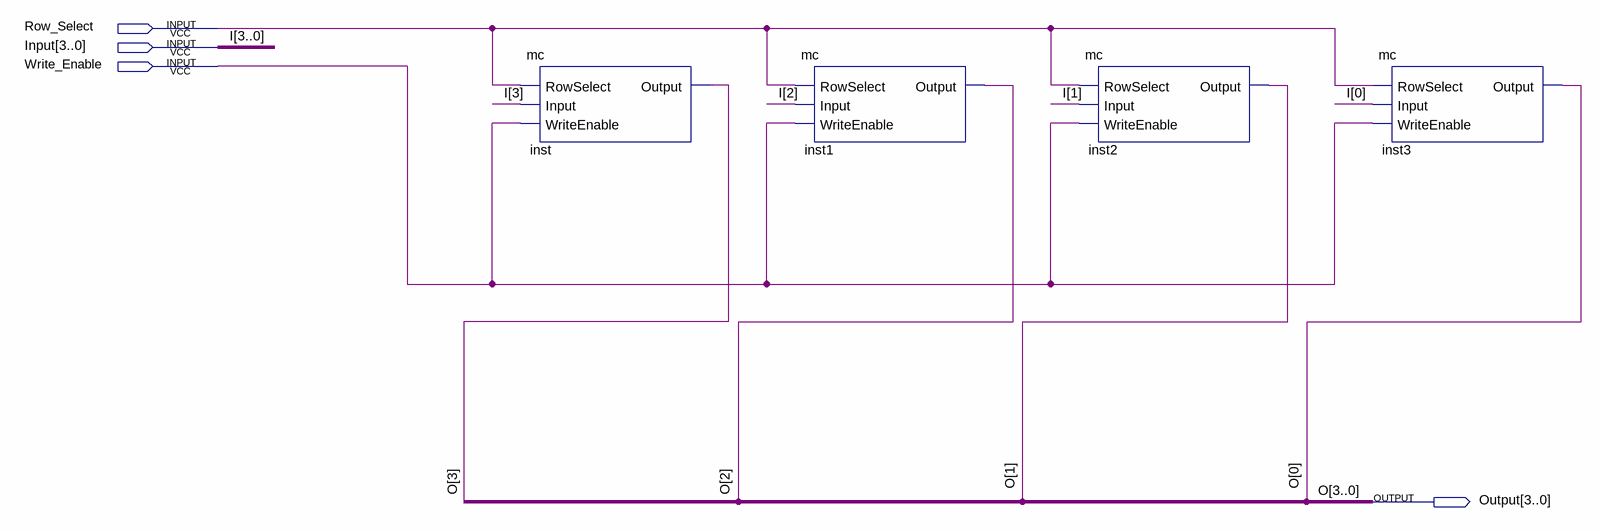
[diagram p0: schematic sheet]
// Quartus schematic 4bit.bdf as structural Verilog: 4 symbols, 4 pins
module \4bit  (
  input  Row_Select,
  input  [3:0] Input,
  input  Write_Enable,
  output [3:0] Output
);

  mc inst (.RowSelect(Row_Select), .Input(Input[3]), .WriteEnable(Write_Enable), .Output(Output[3]));
  mc inst1 (.RowSelect(Row_Select), .Input(Input[2]), .WriteEnable(Write_Enable), .Output(Output[2]));
  mc inst2 (.RowSelect(Row_Select), .Input(Input[1]), .WriteEnable(Write_Enable), .Output(Output[1]));
  mc inst3 (.RowSelect(Row_Select), .Input(Input[0]), .WriteEnable(Write_Enable), .Output(Output[0]));

  // Other names for the same wires on the sheet: I[3:0] = Input; O[3:0] = Output
endmodule
